# Altium schematic sheet Sitara_IO_Power.SchDoc
size A3; SheetNumber: 5; SheetTotal: 5
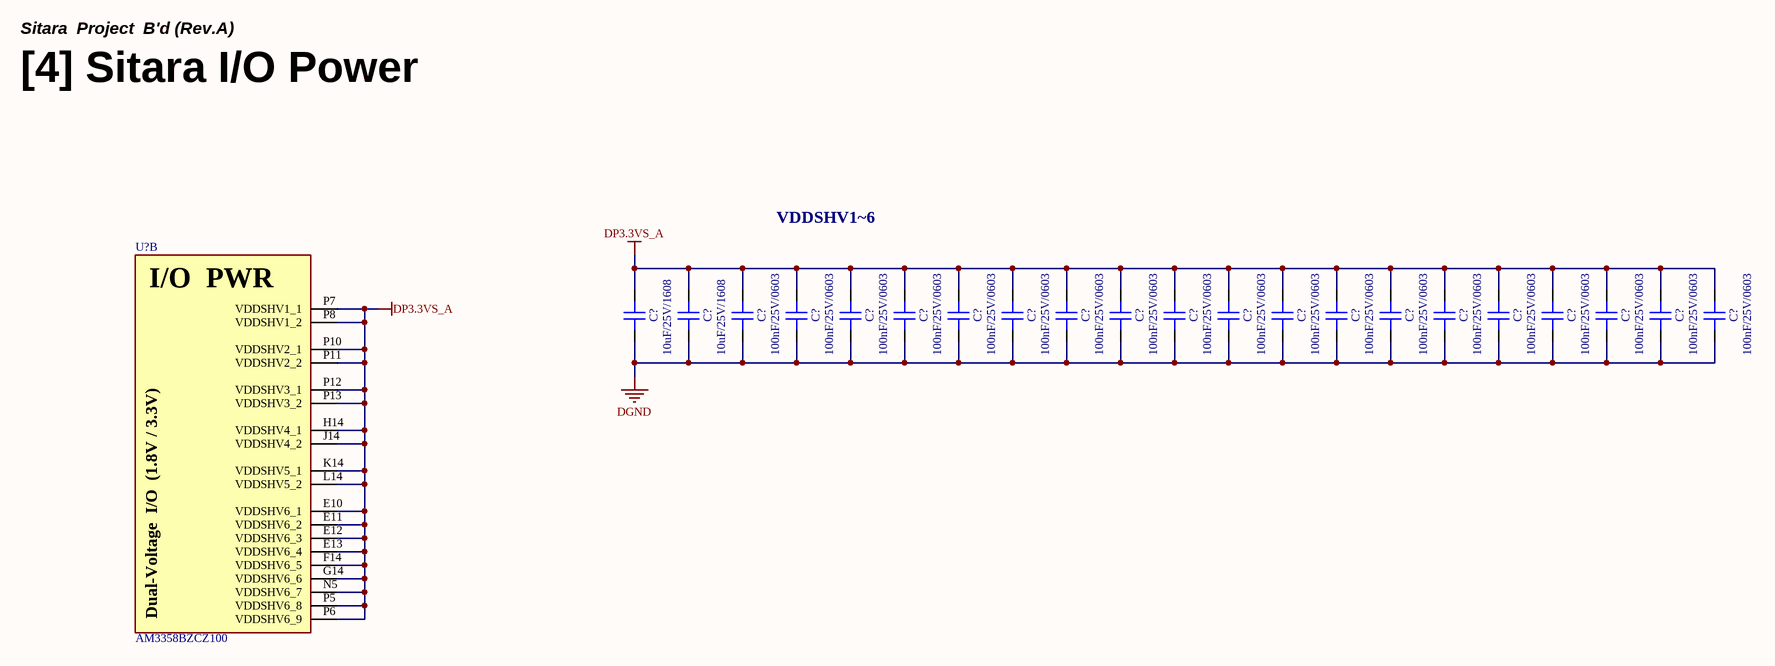
[diagram p0: Sitara_IO_Power.SchDoc]

## Parts
(Parts that share a designator on the sheet are numbered #1, #2 ... from top to bottom, then left to right.)
C?#1  10uF/25V/1608  [CAP 1608 (0603_INCH)]
C?#2  10uF/25V/1608  [CAP 1608 (0603_INCH)]
C?#3  100nF/25V/0603  [CAP 0603 (0201_INCH)]
C?#4  100nF/25V/0603  [CAP 0603 (0201_INCH)]
C?#5  100nF/25V/0603  [CAP 0603 (0201_INCH)]
C?#6  100nF/25V/0603  [CAP 0603 (0201_INCH)]
C?#7  100nF/25V/0603  [CAP 0603 (0201_INCH)]
C?#8  100nF/25V/0603  [CAP 0603 (0201_INCH)]
C?#9  100nF/25V/0603  [CAP 0603 (0201_INCH)]
C?#10  100nF/25V/0603  [CAP 0603 (0201_INCH)]
C?#11  100nF/25V/0603  [CAP 0603 (0201_INCH)]
C?#12  100nF/25V/0603  [CAP 0603 (0201_INCH)]
C?#13  100nF/25V/0603  [CAP 0603 (0201_INCH)]
C?#14  100nF/25V/0603  [CAP 0603 (0201_INCH)]
C?#15  100nF/25V/0603  [CAP 0603 (0201_INCH)]
C?#16  100nF/25V/0603  [CAP 0603 (0201_INCH)]
C?#17  100nF/25V/0603  [CAP 0603 (0201_INCH)]
C?#18  100nF/25V/0603  [CAP 0603 (0201_INCH)]
C?#19  100nF/25V/0603  [CAP 0603 (0201_INCH)]
C?#20  100nF/25V/0603  [CAP 0603 (0201_INCH)]
C?#21  100nF/25V/0603  [CAP 0603 (0201_INCH)]
U?  AM3358BZCZ100  [BGA324C80P18X18_1500X1500X140]  (part B of 8)

## Nets
DGND: C?#1.1 C?#2.1 C?#3.1 C?#4.1 C?#5.1 C?#6.1 C?#7.1 C?#8.1 C?#9.1 C?#10.1 C?#11.1 C?#12.1 C?#13.1 C?#14.1 C?#15.1 C?#16.1 C?#17.1 C?#18.1 C?#19.1 C?#20.1 C?#21.1
DP3.3VS_A: C?#1.2 C?#2.2 C?#3.2 C?#4.2 C?#5.2 C?#6.2 C?#7.2 C?#8.2 C?#9.2 C?#10.2 C?#11.2 C?#12.2 C?#13.2 C?#14.2 C?#15.2 C?#16.2 C?#17.2 C?#18.2 C?#19.2 C?#20.2 C?#21.2 U?.E10(VDDSHV6_1) U?.E11(VDDSHV6_2) U?.E12(VDDSHV6_3) U?.E13(VDDSHV6_4) U?.F14(VDDSHV6_5) U?.G14(VDDSHV6_6) U?.H14(VDDSHV4_1) U?.J14(VDDSHV4_2) U?.K14(VDDSHV5_1) U?.L14(VDDSHV5_2) U?.N5(VDDSHV6_7) U?.P5(VDDSHV6_8) U?.P6(VDDSHV6_9) U?.P7(VDDSHV1_1) U?.P8(VDDSHV1_2) U?.P10(VDDSHV2_1) U?.P11(VDDSHV2_2) U?.P12(VDDSHV3_1) U?.P13(VDDSHV3_2)

## Notes on the sheet
- Sitara  Project  B'd (Rev.A)
- [4] Sitara I/O Power
- VDDSHV1~6
- Title
- Rev
- Doc
- Sheet #
- of
- Engineer
- This document is copyright of ArkX and shall not be revealed, produced, copied, in whole or in part,
- Date
- nor used for any purpose other than submitted.
- (in symbol IC_SOC_AM3358BZCZ100, part B) I/O  PWR; Dual-Voltage  I/O  (1.8V / 3.3V)

## Library data of the parts
C?#1 C?#2 = CAP_10uF/25V/1608: Ceramic CAP_10uF/25V/1608; LCSC Part #: C96446; JLCPCB Part Type: Basic Part
C?#3-C?#21 = CAP_100nF/25V/0603: Ceramic CAP_100nF/25V/0603; JLCPCB Part Type: Extended Part; LCSC Part #: C181047
U? = IC_SOC_AM3358BZCZ100: ARM® Cortex®-A8 Microprocessor IC Sitara™ 1 Core, 32-Bit 1.0GHz 324-NFBGA (15x15); LCSC Part #: C73932; JLCPCB Part Type: Extended Part